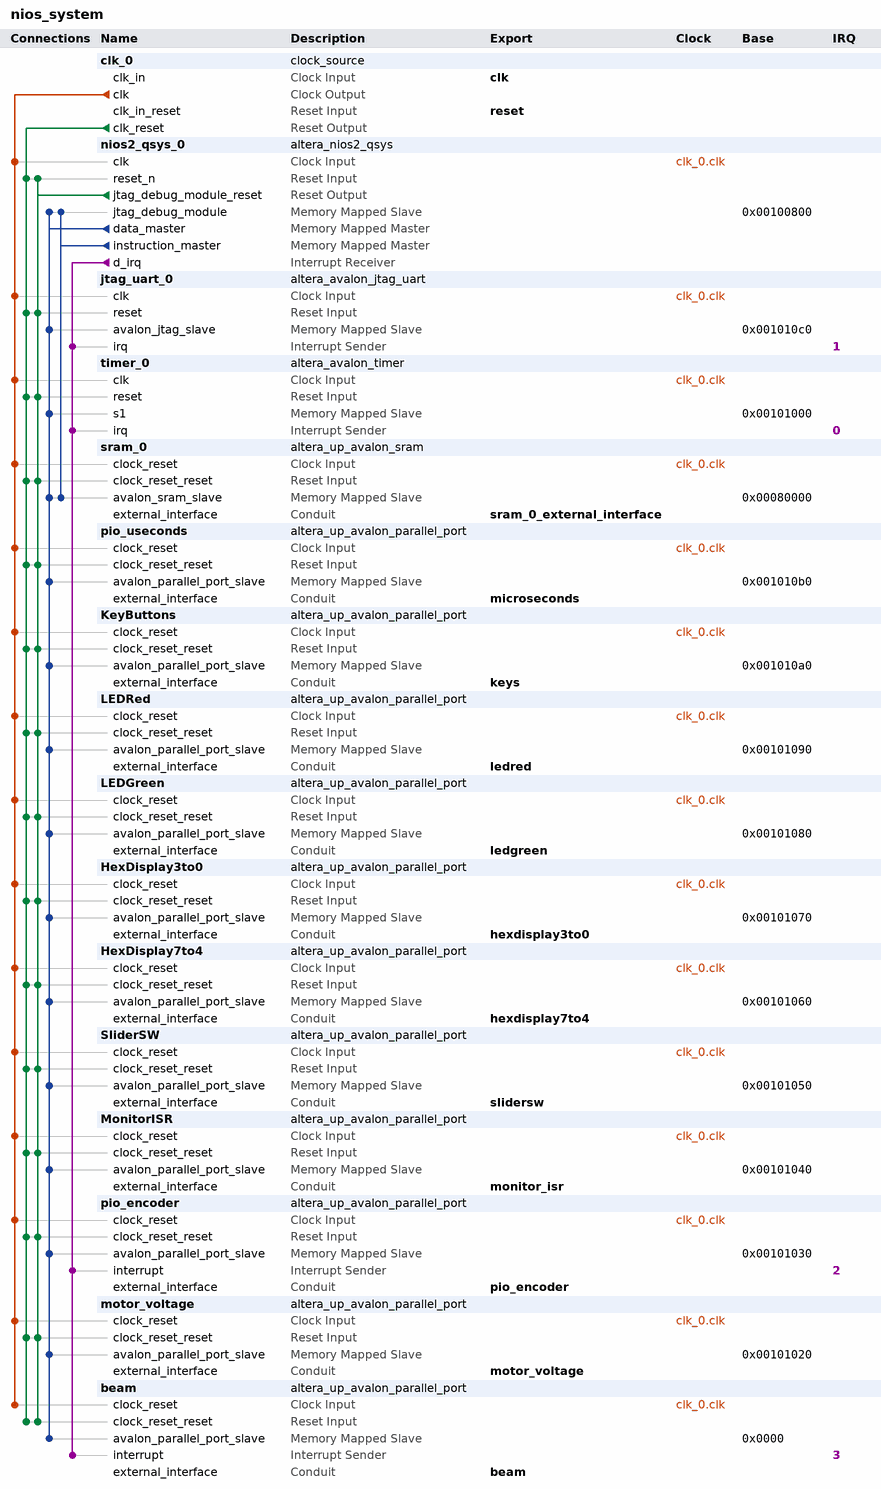
[diagram p0: system contents]
# Platform Designer (Qsys) system nios_system, Cyclone II EP2C35F672C6
# Parameters at their usual value, and those the tool derives, are not listed.
package require -exact qsys 13.0
create_system nios_system
set_project_property DEVICE_FAMILY {Cyclone II}
set_project_property DEVICE EP2C35F672C6

add_instance clk_0 clock_source 13.0
set_instance_parameter_value clk_0 clockFrequency 50000000

add_instance nios2_qsys_0 altera_nios2_qsys 13.0
set_instance_parameter_value nios2_qsys_0 resetSlave sram_0.avalon_sram_slave
set_instance_parameter_value nios2_qsys_0 mmu_TLBMissExcSlave None
set_instance_parameter_value nios2_qsys_0 exceptionSlave sram_0.avalon_sram_slave
set_instance_parameter_value nios2_qsys_0 breakSlave nios2_qsys_0.jtag_debug_module
set_instance_parameter_value nios2_qsys_0 impl Tiny
set_instance_parameter_value nios2_qsys_0 icache_size 4096

add_instance jtag_uart_0 altera_avalon_jtag_uart 13.0.1.99.2
set_instance_parameter_value jtag_uart_0 simInteractiveOptions NO_INTERACTIVE_WINDOWS

add_instance timer_0 altera_avalon_timer 13.0.1.99.2
set_instance_parameter_value timer_0 period 1
set_instance_parameter_value timer_0 periodUnits MSEC

add_instance sram_0 altera_up_avalon_sram 13.0
set_instance_parameter_value sram_0 board DE2
set_instance_parameter_value sram_0 pixel_buffer false

add_instance pio_useconds altera_up_avalon_parallel_port 13.0
set_instance_parameter_value pio_useconds board DE2
set_instance_parameter_value pio_useconds custom_port true
set_instance_parameter_value pio_useconds preset Pushbuttons
set_instance_parameter_value pio_useconds capture true
set_instance_parameter_value pio_useconds edge Rising
set_instance_parameter_value pio_useconds irq false

add_instance KeyButtons altera_up_avalon_parallel_port 13.0
set_instance_parameter_value KeyButtons board DE2
set_instance_parameter_value KeyButtons preset Pushbuttons
set_instance_parameter_value KeyButtons capture false
set_instance_parameter_value KeyButtons edge Rising
set_instance_parameter_value KeyButtons irq false

add_instance LEDRed altera_up_avalon_parallel_port 13.0
set_instance_parameter_value LEDRed board DE2
set_instance_parameter_value LEDRed preset LEDs
set_instance_parameter_value LEDRed leds Red
set_instance_parameter_value LEDRed capture false
set_instance_parameter_value LEDRed edge Rising
set_instance_parameter_value LEDRed irq false

add_instance LEDGreen altera_up_avalon_parallel_port 13.0
set_instance_parameter_value LEDGreen board DE2
set_instance_parameter_value LEDGreen preset LEDs
set_instance_parameter_value LEDGreen capture false
set_instance_parameter_value LEDGreen edge Rising
set_instance_parameter_value LEDGreen irq false

add_instance HexDisplay3to0 altera_up_avalon_parallel_port 13.0
set_instance_parameter_value HexDisplay3to0 board DE2
set_instance_parameter_value HexDisplay3to0 preset {Seven Segment Displays}
set_instance_parameter_value HexDisplay3to0 capture false
set_instance_parameter_value HexDisplay3to0 edge Rising
set_instance_parameter_value HexDisplay3to0 irq false

add_instance HexDisplay7to4 altera_up_avalon_parallel_port 13.0
set_instance_parameter_value HexDisplay7to4 board DE2
set_instance_parameter_value HexDisplay7to4 preset {Seven Segment Displays}
set_instance_parameter_value HexDisplay7to4 sevensegs {7 to 4}
set_instance_parameter_value HexDisplay7to4 capture false
set_instance_parameter_value HexDisplay7to4 edge Rising
set_instance_parameter_value HexDisplay7to4 irq false

add_instance SliderSW altera_up_avalon_parallel_port 13.0
set_instance_parameter_value SliderSW board DE2
set_instance_parameter_value SliderSW preset {Slider Switches}
set_instance_parameter_value SliderSW capture false
set_instance_parameter_value SliderSW edge Rising
set_instance_parameter_value SliderSW irq false

add_instance MonitorISR altera_up_avalon_parallel_port 13.0
set_instance_parameter_value MonitorISR board DE2
set_instance_parameter_value MonitorISR custom_port true
set_instance_parameter_value MonitorISR preset Pushbuttons
set_instance_parameter_value MonitorISR capture false
set_instance_parameter_value MonitorISR edge Rising
set_instance_parameter_value MonitorISR irq false

add_instance pio_encoder altera_up_avalon_parallel_port 13.0
set_instance_parameter_value pio_encoder board DE2
set_instance_parameter_value pio_encoder custom_port true
set_instance_parameter_value pio_encoder preset Pushbuttons
set_instance_parameter_value pio_encoder capture true
set_instance_parameter_value pio_encoder edge Either
set_instance_parameter_value pio_encoder irq true

add_instance motor_voltage altera_up_avalon_parallel_port 13.0
set_instance_parameter_value motor_voltage board DE2
set_instance_parameter_value motor_voltage custom_port true
set_instance_parameter_value motor_voltage preset Pushbuttons
set_instance_parameter_value motor_voltage capture false
set_instance_parameter_value motor_voltage edge Rising
set_instance_parameter_value motor_voltage irq false

add_instance beam altera_up_avalon_parallel_port 13.0
set_instance_parameter_value beam board DE2
set_instance_parameter_value beam custom_port true
set_instance_parameter_value beam preset Pushbuttons
set_instance_parameter_value beam capture true
set_instance_parameter_value beam edge Either
set_instance_parameter_value beam irq true

# connections
add_connection clk_0.clk beam.clock_reset clock
add_connection clk_0.clk HexDisplay3to0.clock_reset clock
add_connection clk_0.clk HexDisplay7to4.clock_reset clock
add_connection clk_0.clk jtag_uart_0.clk clock
add_connection clk_0.clk KeyButtons.clock_reset clock
add_connection clk_0.clk LEDGreen.clock_reset clock
add_connection clk_0.clk LEDRed.clock_reset clock
add_connection clk_0.clk MonitorISR.clock_reset clock
add_connection clk_0.clk motor_voltage.clock_reset clock
add_connection clk_0.clk nios2_qsys_0.clk clock
add_connection clk_0.clk pio_encoder.clock_reset clock
add_connection clk_0.clk pio_useconds.clock_reset clock
add_connection clk_0.clk SliderSW.clock_reset clock
add_connection clk_0.clk sram_0.clock_reset clock
add_connection clk_0.clk timer_0.clk clock
add_connection clk_0.clk_reset beam.clock_reset_reset reset
add_connection clk_0.clk_reset HexDisplay3to0.clock_reset_reset reset
add_connection clk_0.clk_reset HexDisplay7to4.clock_reset_reset reset
add_connection clk_0.clk_reset jtag_uart_0.reset reset
add_connection clk_0.clk_reset KeyButtons.clock_reset_reset reset
add_connection clk_0.clk_reset LEDGreen.clock_reset_reset reset
add_connection clk_0.clk_reset LEDRed.clock_reset_reset reset
add_connection clk_0.clk_reset MonitorISR.clock_reset_reset reset
add_connection clk_0.clk_reset motor_voltage.clock_reset_reset reset
add_connection clk_0.clk_reset nios2_qsys_0.reset_n reset
add_connection clk_0.clk_reset pio_encoder.clock_reset_reset reset
add_connection clk_0.clk_reset pio_useconds.clock_reset_reset reset
add_connection clk_0.clk_reset SliderSW.clock_reset_reset reset
add_connection clk_0.clk_reset sram_0.clock_reset_reset reset
add_connection clk_0.clk_reset timer_0.reset reset
add_connection nios2_qsys_0.jtag_debug_module_reset beam.clock_reset_reset reset
add_connection nios2_qsys_0.jtag_debug_module_reset HexDisplay3to0.clock_reset_reset reset
add_connection nios2_qsys_0.jtag_debug_module_reset HexDisplay7to4.clock_reset_reset reset
add_connection nios2_qsys_0.jtag_debug_module_reset jtag_uart_0.reset reset
add_connection nios2_qsys_0.jtag_debug_module_reset KeyButtons.clock_reset_reset reset
add_connection nios2_qsys_0.jtag_debug_module_reset LEDGreen.clock_reset_reset reset
add_connection nios2_qsys_0.jtag_debug_module_reset LEDRed.clock_reset_reset reset
add_connection nios2_qsys_0.jtag_debug_module_reset MonitorISR.clock_reset_reset reset
add_connection nios2_qsys_0.jtag_debug_module_reset motor_voltage.clock_reset_reset reset
add_connection nios2_qsys_0.jtag_debug_module_reset nios2_qsys_0.reset_n reset
add_connection nios2_qsys_0.jtag_debug_module_reset pio_encoder.clock_reset_reset reset
add_connection nios2_qsys_0.jtag_debug_module_reset pio_useconds.clock_reset_reset reset
add_connection nios2_qsys_0.jtag_debug_module_reset SliderSW.clock_reset_reset reset
add_connection nios2_qsys_0.jtag_debug_module_reset sram_0.clock_reset_reset reset
add_connection nios2_qsys_0.jtag_debug_module_reset timer_0.reset reset
add_connection nios2_qsys_0.data_master beam.avalon_parallel_port_slave avalon
set_connection_parameter_value nios2_qsys_0.data_master/beam.avalon_parallel_port_slave baseAddress 0x0000
add_connection nios2_qsys_0.data_master HexDisplay3to0.avalon_parallel_port_slave avalon
set_connection_parameter_value nios2_qsys_0.data_master/HexDisplay3to0.avalon_parallel_port_slave baseAddress 0x00101070
add_connection nios2_qsys_0.data_master HexDisplay7to4.avalon_parallel_port_slave avalon
set_connection_parameter_value nios2_qsys_0.data_master/HexDisplay7to4.avalon_parallel_port_slave baseAddress 0x00101060
add_connection nios2_qsys_0.data_master jtag_uart_0.avalon_jtag_slave avalon
set_connection_parameter_value nios2_qsys_0.data_master/jtag_uart_0.avalon_jtag_slave baseAddress 0x001010c0
add_connection nios2_qsys_0.data_master KeyButtons.avalon_parallel_port_slave avalon
set_connection_parameter_value nios2_qsys_0.data_master/KeyButtons.avalon_parallel_port_slave baseAddress 0x001010a0
add_connection nios2_qsys_0.data_master LEDGreen.avalon_parallel_port_slave avalon
set_connection_parameter_value nios2_qsys_0.data_master/LEDGreen.avalon_parallel_port_slave baseAddress 0x00101080
add_connection nios2_qsys_0.data_master LEDRed.avalon_parallel_port_slave avalon
set_connection_parameter_value nios2_qsys_0.data_master/LEDRed.avalon_parallel_port_slave baseAddress 0x00101090
add_connection nios2_qsys_0.data_master MonitorISR.avalon_parallel_port_slave avalon
set_connection_parameter_value nios2_qsys_0.data_master/MonitorISR.avalon_parallel_port_slave baseAddress 0x00101040
add_connection nios2_qsys_0.data_master motor_voltage.avalon_parallel_port_slave avalon
set_connection_parameter_value nios2_qsys_0.data_master/motor_voltage.avalon_parallel_port_slave baseAddress 0x00101020
add_connection nios2_qsys_0.data_master nios2_qsys_0.jtag_debug_module avalon
set_connection_parameter_value nios2_qsys_0.data_master/nios2_qsys_0.jtag_debug_module baseAddress 0x00100800
add_connection nios2_qsys_0.data_master pio_encoder.avalon_parallel_port_slave avalon
set_connection_parameter_value nios2_qsys_0.data_master/pio_encoder.avalon_parallel_port_slave baseAddress 0x00101030
add_connection nios2_qsys_0.data_master pio_useconds.avalon_parallel_port_slave avalon
set_connection_parameter_value nios2_qsys_0.data_master/pio_useconds.avalon_parallel_port_slave baseAddress 0x001010b0
add_connection nios2_qsys_0.data_master SliderSW.avalon_parallel_port_slave avalon
set_connection_parameter_value nios2_qsys_0.data_master/SliderSW.avalon_parallel_port_slave baseAddress 0x00101050
add_connection nios2_qsys_0.data_master sram_0.avalon_sram_slave avalon
set_connection_parameter_value nios2_qsys_0.data_master/sram_0.avalon_sram_slave baseAddress 0x00080000
add_connection nios2_qsys_0.data_master timer_0.s1 avalon
set_connection_parameter_value nios2_qsys_0.data_master/timer_0.s1 baseAddress 0x00101000
add_connection nios2_qsys_0.instruction_master nios2_qsys_0.jtag_debug_module avalon
set_connection_parameter_value nios2_qsys_0.instruction_master/nios2_qsys_0.jtag_debug_module baseAddress 0x00100800
add_connection nios2_qsys_0.instruction_master sram_0.avalon_sram_slave avalon
set_connection_parameter_value nios2_qsys_0.instruction_master/sram_0.avalon_sram_slave baseAddress 0x00080000
add_connection nios2_qsys_0.d_irq beam.interrupt interrupt
set_connection_parameter_value nios2_qsys_0.d_irq/beam.interrupt irqNumber 3
add_connection nios2_qsys_0.d_irq jtag_uart_0.irq interrupt
set_connection_parameter_value nios2_qsys_0.d_irq/jtag_uart_0.irq irqNumber 1
add_connection nios2_qsys_0.d_irq pio_encoder.interrupt interrupt
set_connection_parameter_value nios2_qsys_0.d_irq/pio_encoder.interrupt irqNumber 2
add_connection nios2_qsys_0.d_irq timer_0.irq interrupt
set_connection_parameter_value nios2_qsys_0.d_irq/timer_0.irq irqNumber 0

# exported interfaces
add_interface clk clock sink
set_interface_property clk EXPORT_OF clk_0.clk_in
add_interface reset reset sink
set_interface_property reset EXPORT_OF clk_0.clk_in_reset
add_interface sram_0_external_interface conduit end
set_interface_property sram_0_external_interface EXPORT_OF sram_0.external_interface
add_interface microseconds conduit end
set_interface_property microseconds EXPORT_OF pio_useconds.external_interface
add_interface keys conduit end
set_interface_property keys EXPORT_OF KeyButtons.external_interface
add_interface ledred conduit end
set_interface_property ledred EXPORT_OF LEDRed.external_interface
add_interface ledgreen conduit end
set_interface_property ledgreen EXPORT_OF LEDGreen.external_interface
add_interface hexdisplay3to0 conduit end
set_interface_property hexdisplay3to0 EXPORT_OF HexDisplay3to0.external_interface
add_interface hexdisplay7to4 conduit end
set_interface_property hexdisplay7to4 EXPORT_OF HexDisplay7to4.external_interface
add_interface slidersw conduit end
set_interface_property slidersw EXPORT_OF SliderSW.external_interface
add_interface monitor_isr conduit end
set_interface_property monitor_isr EXPORT_OF MonitorISR.external_interface
add_interface pio_encoder conduit end
set_interface_property pio_encoder EXPORT_OF pio_encoder.external_interface
add_interface motor_voltage conduit end
set_interface_property motor_voltage EXPORT_OF motor_voltage.external_interface
add_interface beam conduit end
set_interface_property beam EXPORT_OF beam.external_interface

set_interconnect_requirement {$system} qsys_mm.clockCrossingAdapter HANDSHAKE
set_interconnect_requirement {$system} qsys_mm.maxAdditionalLatency 1

save_system nios_system.qsys
